# EAGLE design ramp-v1 (EAGLE 5.10)
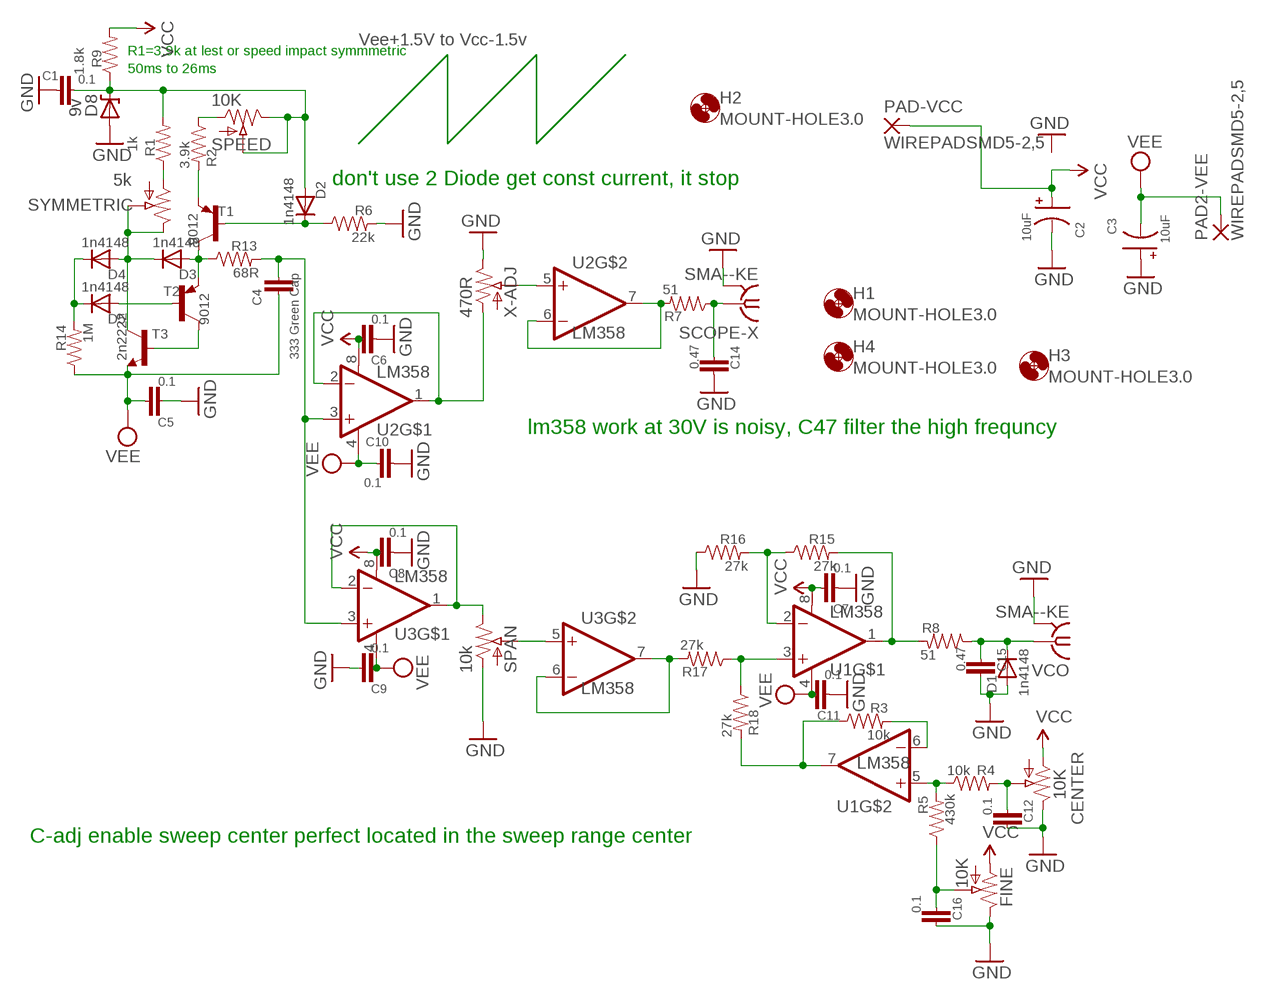
[diagram p0: schematic, sheet 1]

## Parts
C1  0.1  CAP-C0805  [C0805]
C2  10uF  CAP_POL1206  [EIA3216]
C3  10uF  CAP_POL1206  [EIA3216]
C4  333 Green Cap  CAPPTH1  [CAP-PTH-5MM]
C5  0.1  CAP-C0805  [C0805]
C6  0.1  CAP-C0805  [C0805]
C7  0.1  CAP-C0805  [C0805]
C8  0.1  CAP-C0805  [C0805]
C9  0.1  CAP-C0805  [C0805]
C10  0.1  CAP-C0805  [C0805]
C11  0.1  CAP-C0805  [C0805]
C12  0.1  CAP-C0805  [C0805]
C14  0.47  CAP-C0805  [C0805]
C15  0.47  CAP-C0805  [C0805]
C16  0.1  CAP-C0805  [C0805]
CENTER  10K  POTPANNEL  [POT-PANNEL]
D1  1n4148  DIODE1206  [1206-DIODE]
D2  1n4148  DIODE1206  [1206-DIODE]
D3  1n4148  DIODE1206  [1206-DIODE]
D4  1n4148  DIODE1206  [1206-DIODE]
D5  1n4148  DIODE1206  [1206-DIODE]
D8  9v  DIODE-ZENERPTH  [DIODE-ZENER]
FINE  10K  POTPANNEL  [POT-PANNEL]
H1  MOUNT-HOLE3.0  [3,0]
H2  MOUNT-HOLE3.0  [3,0]
H3  MOUNT-HOLE3.0  [3,0]
H4  MOUNT-HOLE3.0  [3,0]
PAD2-VEE  WIREPADSMD5-2,5  [5-2,5]
PAD-VCC  WIREPADSMD5-2,5  [5-2,5]
R1  1k  RESISTOR-R0805W  [R0805W]
R2  3.9k  RESISTOR-R0805W  [R0805W]
R3  10k  RESISTOR-R0805W  [R0805W]
R4  10k  RESISTOR-R0805W  [R0805W]
R5  430k  RESISTOR-R0805W  [R0805W]
R6  22k  RESISTOR-R0805W  [R0805W]
R7  51  RESISTOR-R0805W  [R0805W]
R8  51  RESISTOR-R0805W  [R0805W]
R9  1.8k  RESISTOR-R0805W  [R0805W]
R13  68R  RESISTOR0805  [0805]
R14  1M  RESISTOR-R0805W  [R0805W]
R15  27k  RESISTOR-R0805W  [R0805W]
R16  27k  RESISTOR-R0805W  [R0805W]
R17  27k  RESISTOR-R0805W  [R0805W]
R18  27k  RESISTOR-R0805W  [R0805W]
SCOPE-X  SMA--KE  [SMA-KE]
SPAN  10k  POTPANNEL  [POT-PANNEL]
SPEED  10K  POTPANNEL  [POT-PANNEL]
SYMMETRIC  5k  POTB25P-3362P  [B25P]
T1  9012  90**-PNP-TO92-EBC  [TO92-EBC]
T2  9012  90**-PNP-TO92-EBC  [TO92-EBC]
T3  2n2222  -NPN-TO92-EBC  [TO92-EBC]
U1  LM358  LM358-SO08  [SO08]
U2  LM358  LM358-SO08  [SO08]
U3  LM358  LM358-SO08  [SO08]
VCO  SMA--KE  [SMA-KE]
X-ADJ  470R  POTB25P-3362P  [B25P]

## Nets
GND: C1.1 C2.C(-) C3.A(+) C5.2 C6.2 C7.2 C8.2 C9.1 C10.1 C11.2 C12.1 C14.1 C15.1 C16.1 CENTER.E D1.A D8.P$2(A) FINE.E R6.2 R16.1 SCOPE-X.G@1(GND) SPAN.A VCO.G@1(GND) X-ADJ.E
N$1: C1.2 D2.A D8.P$1(C) R1.2 R9.1 SPEED.E SPEED.S
N$3: SPAN.E U3.1(OUT) U3.2(-IN)
N$4: R4.1 R5.2 U1.5(+IN)
N$5: D3.A R13.1 T1.C T2.E
N$6: D5.A T2.B
N$7: T2.C T3.B
N$8: D4.K(C) D5.K(C) R14.2
N$9: D3.K(C) D4.A SYMMETRIC.E SYMMETRIC.S T3.C
N$10: R2.2 T1.E
N$11: R17.1 R18.1 U1.3(+IN)
N$12: R2.1 SPEED.A
N$13: D2.K(C) R6.1 T1.B
N$14: C4.1 R13.2 U2.3(+IN) U3.3(+IN)
N$15: R1.1 SYMMETRIC.A
N$16: SPAN.S U3.5(+IN)
N$17: U2.1(OUT) U2.2(-IN) X-ADJ.A
N$18: U2.5(+IN) X-ADJ.S
N$19: R17.2 U3.6(-IN) U3.7(OUT)
N$21: C12.2 CENTER.S R4.2
N$22: C16.2 FINE.S R5.1
N$23: R15.1 R16.2 U1.2(-IN)
N$24: R7.2 U2.6(-IN) U2.7(OUT)
N$25: C14.2 R7.1 SCOPE-X.1
N$26: R8.2 R15.2 U1.1(OUT)
N$27: C15.2 D1.K(C) R8.1 VCO.1
N$28: R3.1 R18.2 U1.7(OUT)
N$29: R3.2 U1.6(-IN)
VCC: C2.A(+) C6.1 C7.1 C8.1 CENTER.A FINE.A PAD-VCC.1(P) R9.2 U1.8(V+) U2.8(V+) U3.8(V+)
VEE: C3.C(-) C4.2 C5.1 C9.2 C10.2 C11.1 PAD2-VEE.1(P) R14.1 T3.E U1.4(V-) U2.4(V-) U3.4(V-)

## Notes on the sheet
- R1=3.9k at lest or speed impact symmmetric | Vee+1.5V to Vcc-1.5v
- 50ms to 26ms
- don't use 2 Diode get const current, it stop
- lm358 work at 30V is noisy, C47 filter the high frequncy
- C-adj enable sweep center perfect located in the sweep range center

## Power pins joined to a net without a drawn wire
GND: SCOPE-X.G@2(GND) SCOPE-X.G@3(GND) SCOPE-X.G@4(GND) VCO.G@2(GND) VCO.G@3(GND) VCO.G@4(GND)

## Library data of the parts
C1 C4-C12 C14-C16 = digital-toy:CAP: Capacitor Standard 0603 ceramic capacitor, and 0.1" leaded capacitor.
C2 C3 = digital-toy:CAP_POL: Capacitor Polarized These are standard SMD and PTH capacitors. Normally 10uF, 47uF, and 100uF in electrolytic and tantalum varieties. Always verify the external diameter of the through hole cap, it varies with capacity, voltage, and manufacturer. The EIA devices should be standard. PANASONIC_D size: 6.5mmx6.5mmx5.5mm, 100uf (taobao:6.3mmx5.5mm), same as CVL0605 153cvl0405 size: 4mmx4mmx5.5mm, 10uf (taobao:4mmx5.5mm) ct6032 typical 47uF Tantalum, comment by hyl.
CENTER FINE SPAN SPEED SYMMETRIC X-ADJ = digital-toy:POT: POT digital toy POT, 3296 multi turn, blue-white ... hyl 8/07/2001
D1-D5 = digital-toy:DIODE: Diode These are standard reverse protection diodes and small signal diodes. SMA package can handle up to about 1A. SOD-323 can handle about 200mA. What the SOD-323 package when ordering, there are some mfgs out there that are 5-pin packages.
D8 = digital-toy:DIODE-ZENER: Zener Diode Production Part - 8199 3.4V Zener Voltage
H1-H4 = holes:MOUNT-HOLE: MOUNTING HOLE with drill center marker
PAD2-VEE PAD-VCC = wirepad:WIREPAD: Wire PAD connect wire on PCB
R1-R9 R13-R18 = digital-toy:RESISTOR: Resistor Basic schematic elements and footprints for 0603, 1206, and PTH 1/10th watt (small) resistors. digital-toy copy vertical mount of axial-0.3 from rcl.lbr : the 0207/xx 3W resistor: 0617/17, 0617/22, 0617V
SCOPE-X VCO = dtoy-RF:SMA-: SMA 50 Ohm End Launch Jack Receptacle - Round Contact Johnson Components Source: www.johnsoncomponents.com .. J502-ND.pdf
T1 T2 = digital-toy:*-PNP-: PNP Transistror
T3 = digital-toy:*-NPN-: NPN Transistror most of sot-23 use the pacages sot23-BEC, top C, left B, right E. by hyl, digital-toy. and to-92 use ebc(from-top) by hyl, digital-toy.
U1-U3 = digital-toy:LM358

## Board
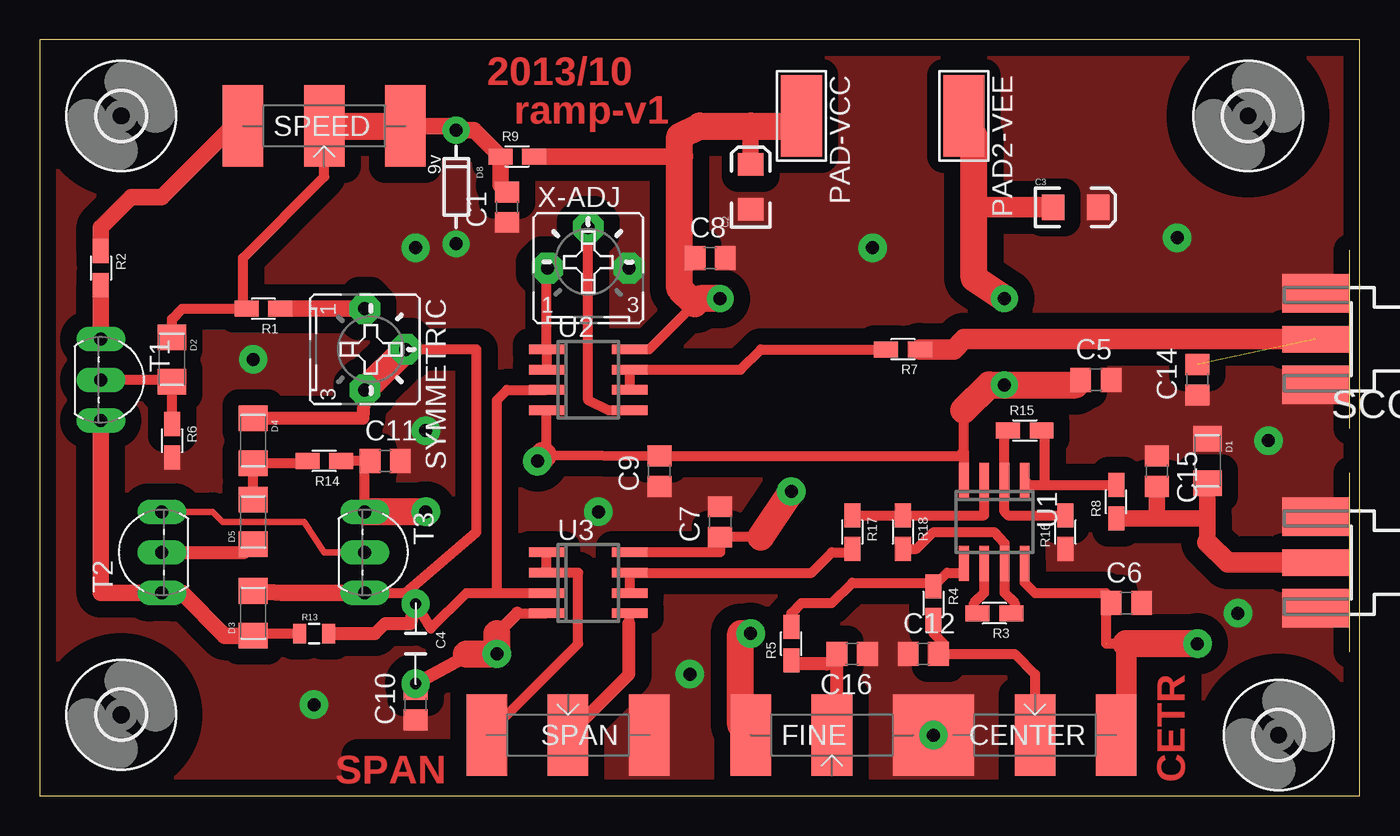
[diagram p1: board, top side]
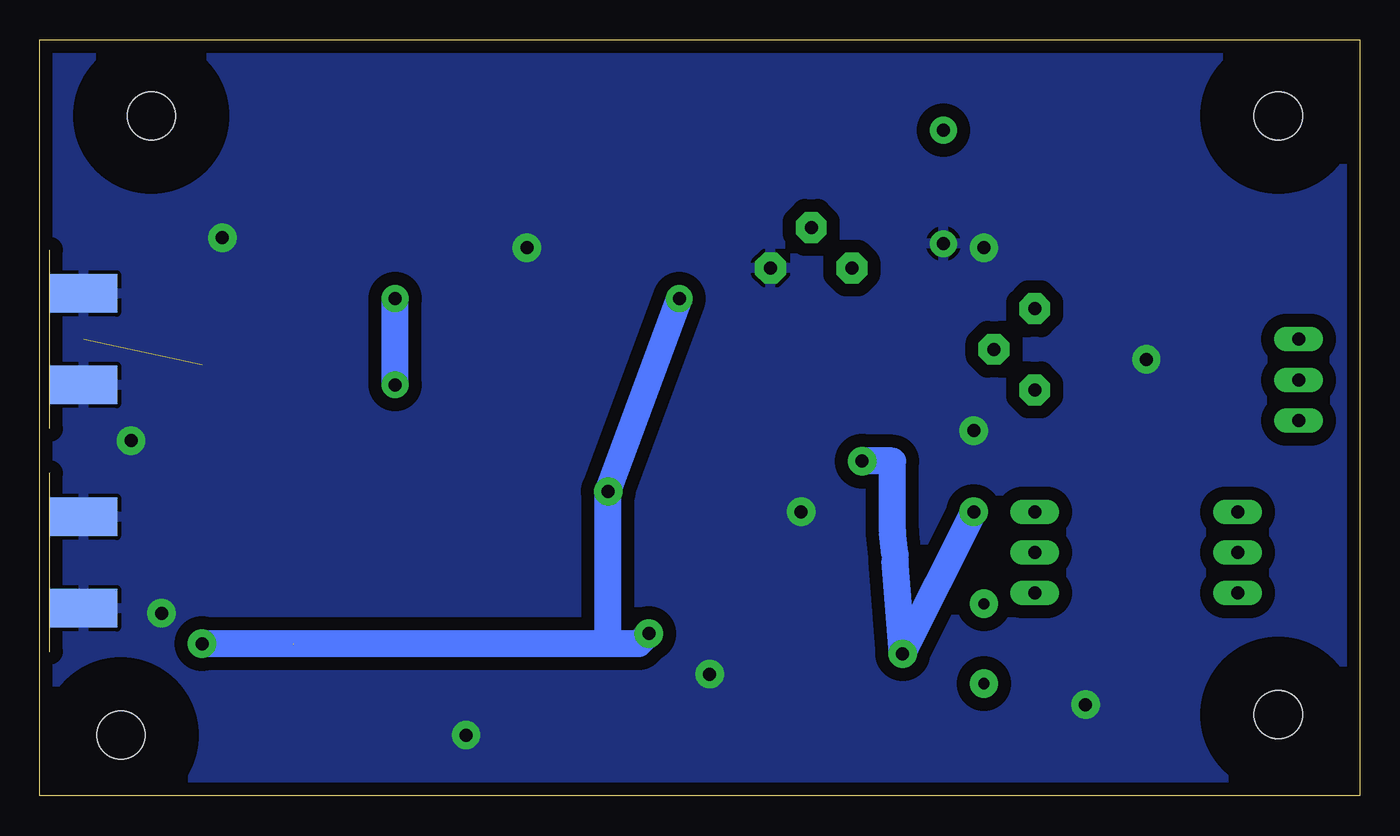
[diagram p2: board, bottom side, seen from below]

Size 82.53 x 47.29 mm. Coordinates in mm from the lower left corner, seen from the top.
Outline: 0,0 82.53,0 82.53,47.29 0,47.29 0,0
Copper layers (1*16): Top 0.035mm / dielectric 1.5mm / Bottom 0.035mm
Design rules "SparkFun-HP1007-600x600dpi": minimum track width 10mil, minimum drill 20mil, track to track 12mil, track to pad 12mil, pad to pad 12mil, via to via 12mil, smd to smd 12mil, copper to edge 12mil, drill to drill 12mil, minimum pad ring 12mil, minimum via ring 10mil, stop-mask expansion 4mil, vias tented up to drill 25mil, thermal gap 10mil

### Footprints (pad centres in the part's own frame; a part is rotated, then mirrored left to right if it is on the bottom)
C0805 = smd 1.3 x 1.5: 1 -0.95,0; 2 0.95,0
EIA3216 = smd 1.4 x 1.6: A 1.4,0; C -1.4,0
CAP-PTH-5MM = drill 0.7 pad 1.778 round: 1 -2.5,0; 2 2.5,0
POT-PANNEL = smd 2.54 x 5.08: A -6.35,0; E 3.81,0; S -1.27,0
1206-DIODE = smd 1.6 x 1.8: A -1.4,0; K 1.4,0
DIODE-ZENER = drill 0.813 pad 1.676 round: P$1 -3.556,0; P$2 3.556,0
3,0 = hole 3: 0,0
5-2,5 = smd 2.54 x 5.08: 1 0,0
R0805W = smd 1.5 x 1: 1 -1.052,0; 2 1.052,0
0805 = smd 0.8 x 1.2: 1 -0.9,0; 2 0.9,0
SMA-KE = smd 4.191 x 1.651: 1 2.115,0 | smd 4.191 x 2.413: G@1 2.115,2.86; G@2 2.115,-2.86 | smd 4.191 x 2.413 bottom: G@3 2.115,2.86; G@4 2.115,-2.86
B25P = drill 0.813 pad 1.93 octagon: A -2.54,0; E 2.54,0; S 0,2.54
TO92-EBC = drill 0.813 pad 1.524 long: B 0,-1.27; C 2.54,-1.27; E -2.54,-1.27
SO08 = smd 0.6 x 2.2: 1 -1.905,-2.6; 2 -0.635,-2.6; 3 0.635,-2.6; 4 1.905,-2.6; 5 1.905,2.6; 6 0.635,2.6; 7 -0.635,2.6; 8 -1.905,2.6

### Placement (x,y rotation side)
C1  29.21,36.83 90 top
C2  44.45,38.1 90 top
C3  64.77,36.83 0 top
C4  23.5,9.53 270 top
C5  66.04,26.04 0 top
C6  67.95,12.06 0 top
C7  42.54,17.15 90 top
C8  41.91,33.66 0 top
C9  38.73,20.32 90 top
C10  23.5,5.71 90 top
C11  21.59,20.96 0 top
C12  103  [C0805]  55.24,8.89 0 top
C14  72.39,26.04 90 top
C15  69.85,20.32 270 top
C16  50.8,8.89 180 top
CENTER  60.96,3.81 180 top
D1  73.03,20.96 270 top
D2  8.26,27.31 270 top
D3  13.33,11.43 90 top
D4  13.33,22.23 270 top
D5  13.33,17.15 90 top
D8  26.04,38.1 270 top
FINE  50.8,3.81 0 top
H1  5.08,42.54 0 top
H2  77.47,3.81 0 top
H3  75.57,42.54 0 top
H4  5.08,5.08 0 top
PAD2-VEE  57.78,42.54 180 top
PAD-VCC  47.62,42.54 180 top
R1  13.97,30.48 180 top
R2  3.81,33.02 270 top
R3  59.69,11.43 180 top
R4  55.88,12.06 270 top
R5  46.99,9.53 90 top
R6  8.26,22.23 270 top
R7  53.98,27.94 180 top
R8  470  [R0805W]  67.31,18.42 90 top
R9  29.85,40 0 top
R13  17.15,10.16 0 top
R14  17.78,20.96 180 top
R15  61.59,22.86 0 top
R16  64.14,16.51 90 top
R17  50.8,16.51 270 top
R18  53.98,16.51 270 top
SCOPE-X  81.92,28.58 180 top
SPAN  31.75,3.81 180 top
SPEED  19.05,41.91 0 top
SYMMETRIC  20.32,27.94 270 top
T1  5.08,26.04 270 top
T2  6.35,15.24 90 top
T3  21.59,15.24 270 top
U1  59.69,17.15 180 top
U2  34.29,26.04 270 top
U3  34.29,13.33 270 top
VCO  81.92,14.61 180 top
X-ADJ  34.29,33.02 0 top

### Tracks (layer width: path | path; a pad name or v marks a point on that pad's centre or on a via)
GND  (via drill 0.81 pad 1.78)
  Top 0.61: v55.88,3.81 CENTER.E
  other vias: 13.33,27.31 17.15,5.71 71.12,34.92 76.84,22.23 34.92,17.78 23.5,34.29 24.13,22.86 52.07,34.29 40.64,7.62 74.93,11.43
  pour Top (isolate 1.016, no thermals): 5.71,55.88 55.24,55.24 62.23,56.52 67.31,53.34 67.95,52.7 67.95,52.07 69.22,52.07 69.22,52.7 69.85,53.34 70.48,52.7 71.76,52.7 73.66,53.34 78.11,55.24 77.47,53.34 85.73,47.62 95.89,43.18 85.73,-1.91 59.05,-1.91 12.06,-3.81 -4.45,0 -4.45,53.98
  pour Bottom (isolate 0.813): -3.17,52.7 60.32,53.98 88.9,50.8 90.81,-5.08 20.32,-15.24 -10.79,-6.35 -2.54,52.7
N$1
  Top 0.61: SPEED.S 17.78,38.73 12.7,33.66 12.7,30.7 R1.2 8.89,30.48 8.26,29.85 D2.A | 25.78,41.91 D8.P$1 | 28.79,38.2 C1.2
  Top 1.016: SPEED.E 25.78,41.91 | D8.P$1 27.14,41.66 R9.1 28.79,38.2
  Top 1.676: SPEED.S SPEED.E
N$3
  Top 0.61: U3.1 U3.2 33.66,13.97 33.66,9.53 SPAN.E
N$4
  Top 0.61: U1.5 57.78,13.97 56.73,13.97 R4.1 55.66,13.33 50.8,13.33 49.53,12.06 47.62,12.06 46.99,11.43 R5.2
N$5
  Top 0.61: D3.A 13.46,10.16 R13.1
  Top 1.016: T1.C 3.81,12.7 T2.E 8.89,12.7 11.56,10.03 D3.A
N$6
  Top 0.813: T2.B 12.83,15.24 D5.A
N$7
  Top 0.406: T2.C 10.79,17.78 11.43,17.15 16.51,17.15 17.78,15.24 T3.B
N$8
  Top 0.61: D5.K D4.K 16.64,20.83 16.51,20.96 R14.2
N$9
  Top 0.61: T3.C 22.86,12.7 27.31,16.51 27.31,27.94 SYMMETRIC.S
  Top 0.813: D4.A 20.19,23.62 SYMMETRIC.E
  Top 1.016: D3.K 15.11,12.7 T3.C
  Top 1.676: SYMMETRIC.S SYMMETRIC.E
N$10
  Top 1.016: T1.E R2.2
N$11
  Top 0.61: R17.1 R18.1 59.05,17.56 U1.3
N$12
  Top 1.016: SPEED.A 12.06,41.91 7.62,37.46 5.71,37.46 3.81,35.56 R2.1
N$13
  Top 0.61: T1.B 8.12,26.04 D2.K R6.1
N$14
  Top 0.61: U2.3 29.21,25.4 28.58,24.77 28.58,12.7 | C4.1 24.45,10.47 26.67,12.7 28.58,12.7 | 28.58,12.7 U3.3
  Top 0.813: R13.2 20.96,10.16 21.59,10.79 23.18,10.79 C4.1
N$15
  Top 1.016: R1.1 SYMMETRIC.A
N$16
  Top 0.61: 36.83,10.79 U3.5
  Top 0.813: SPAN.S 36.83,7.62 36.83,10.79
N$17
  Top 0.61: U2.2 U2.1 31.69,32.33 X-ADJ.A
N$18
  Top 0.61: U2.5 35.56,24.13 34.29,24.77 X-ADJ.S
N$19
  Top 0.406: 50.58,15.24 R17.2
  Top 0.61: U3.6 U3.7 48.26,13.97 49.53,15.24 50.58,15.24
N$21
  Top 0.61: R4.2 55.88,10.16 56.52,9.53 56.52,9.21 C12.2 60.96,8.89 62.23,7.62 CENTER.S
N$22
  Top 0.61: 46.99,8.26 R5.1 | C16.2 arc-90 49.21,8.26 | FINE.S 49.85,4.13
  Top 0.813: 49.21,8.26 46.99,8.26 | 49.85,4.13 C16.2
N$23
  Top 0.61: R15.1 60.32,22.64 U1.2 60.32,17.78 60.54,17.56 R16.2
N$24
  Top 0.61: R7.2 45.09,27.94 43.81,26.67 U2.7 U2.6
N$25  (1 unrouted)
  Top 1.27: R7.1 57.15,27.94 57.78,28.58 SCOPE-X.1
N$26
  Top 0.61: U1.1 61.87,19.47 62.86,19.47 | 62.86,19.47 R8.2 | R15.2 62.86,22.64 62.86,19.47
N$27
  Top 1.016: R8.1 69.85,17.36 | 69.85,17.36 73.03,17.36 | 73.03,17.36 73.03,15.88 | 69.85,17.36 C15.2 | 73.03,17.36 D1.K
  Top 1.27: 73.03,15.88 74.3,14.61 VCO.1
N$28
  Top 0.61: R18.2 54.83,15.46 55.88,16.51 59.69,16.51 60.32,15.81 U1.7 60.32,12.7 60.96,12.06 60.96,11.65 R3.1
N$29
  Top 0.61: U1.6 59.05,12.7 58.42,12.06 58.42,11.43 R3.2
VCC  (via drill 0.81 pad 1.68, 0.81 pad 1.78)  (1 unrouted)
  Top 0.61: 67.95,9.53 66.68,9.53 | U2.8 38.1,27.94 40.96,30.8 | 46.99,41.91 PAD-VCC.1 | U3.8 42.54,15.24 C7.1 45.09,16.2 | FINE.A 43.81,4.45 | 67.95,3.81 CENTER.A | 67,11.74 66.68,11.74 66.68,9.53 | U1.8 61.59,13.33 62.23,12.7 66.68,12.7 66.68,12.38 C6.1 | 40,33.66 C8.1
  Top 0.813: C6.1 67,11.74
  Top 1.016: 44.45,41.91 C2.A | 40,40 R9.2
  Top 1.27: 67.95,9.53 67.95,3.81
  Top 1.676: v72.39,9.53 67.95,9.53 | 46.99,41.91 44.45,41.91 41.27,41.91 40,41.27 40,40 40,33.66 40,31.75 40.96,30.8 41.27,31.12 v42.54,31.12 | v46.99,19.05 45.09,16.2 | 43.81,4.45 43.81,10.16 v44.45,10.16
  Bottom 1.676: v42.54,31.12 v46.99,19.05 46.99,9.53 | 46.99,9.53 v72.39,9.53 | v44.45,10.16 45.09,9.53 46.99,9.53
VEE  (via drill 0.81 pad 1.68, 0.81 pad 1.78)
  Top 0.61: C10.2 C4.2 | R14.1 C11.1 20.32,21.27 T3.E | 57.78,21.59 U1.4 | 31.69,21.33 U2.4 | 31.69,21.33 C9.2 57.46,21.27 57.78,21.59 | 31.49,21.33 31.69,21.33 | 57.78,21.59 57.78,24.13 | 64.77,25.72 C5.1 | 58.42,41.27 57.78,41.91 PAD2-VEE.1 | 29.85,11.43 U3.4
  Top 0.813: C4.2 26.36,8.58 26.67,8.89 | 28.58,10.16 29.85,11.43
  Top 1.27: 58.42,36.83 C3.C
  Top 1.676: v24.13,17.78 T3.E | v31.12,20.96 31.49,21.33 | 57.78,24.13 59.38,25.72 v60.32,25.72 64.77,25.72 | v60.32,31.12 58.42,32.38 58.42,36.83 58.42,41.27 | 26.67,8.89 v28.58,8.89 28.58,10.16
  Bottom 0.61: 29.05,14.76 29.05,15.1
  Bottom 1.676: v24.13,17.78 v28.58,8.89 29.05,14.76 | v31.12,20.96 29.21,20.96 29.21,16.53 29.05,15.1 | v60.32,25.72 v60.32,31.12

### Text on the board
Top: 2013/10 | ramp-v1 | CETR | SPAN